# Altium schematic sheet [SH][SFW2] V1.0.SchDoc
size A4
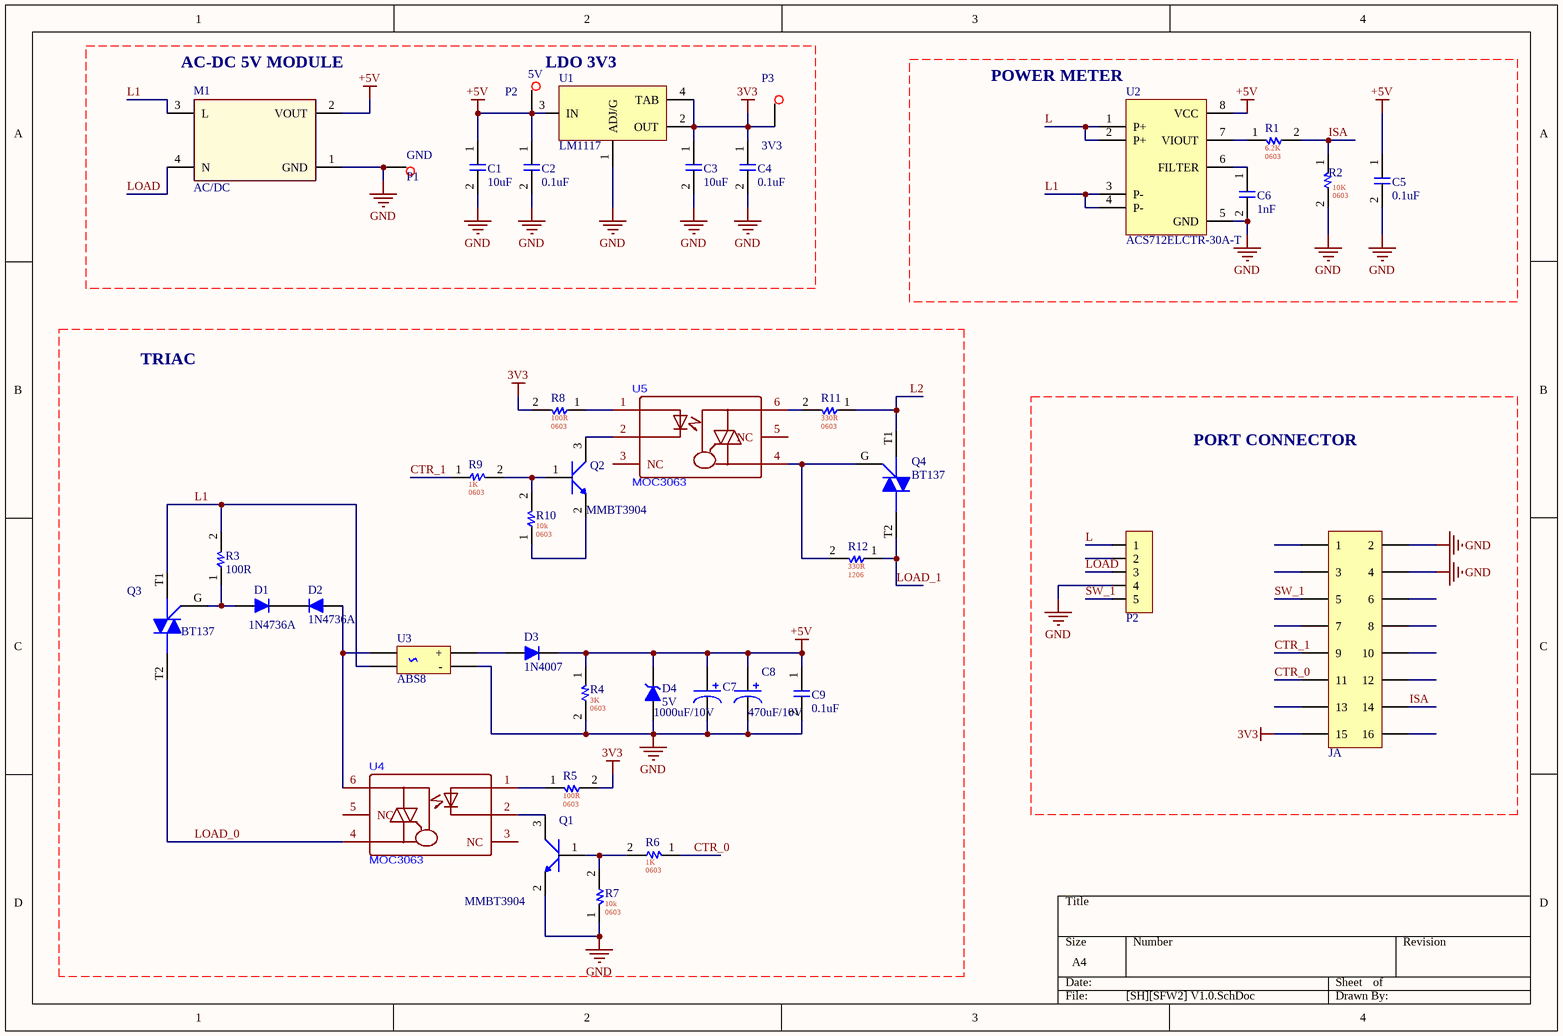
[diagram p0: [SH][SFW2] V1.0.SchDoc]

## Parts
3V3  P3  [TEXT_POINT]
5V  P2  [TEXT_POINT]
C1  10uF  [0805 C]
C2  0.1uF  [0603 C]
C3  10uF  [0805 C]
C4  0.1uF  [0603 C]
C5  0.1uF  [0603 C]
C6  1nF  [0603 C]
C7  1000uF/10V  [CAPAP 8X11.5 P3.5]
C8  470uF/10V  [CAPAE 5X9 P2 ORANGE]
C9  0.1uF  [0603 C]
D1  1N4736A  [DO214AC]
D2  1N4736A  [DO214AC]
D3  1N4007  [SOD-323]
D4  5V  [SOD-80C]
GND  P1  [TEXT_POINT]
JA  rao doi  [T]  (value not drawn)
M1  AC/DC  [AC-DC 5V K4H24]
P2  P5  [TBL004V]  (value not drawn)
Q1  MMBT3904  [SOT 23-3]
Q2  MMBT3904  [SOT 23-3]
Q3  BT137  [TO_252]
Q4  BT137  [TO_252]
R1  value 6.2K  FP: 0603  [0603 R]  (hidden comment: 3K)
R2  value 10K  FP: 0603  [0603 R]  (hidden comment: 3K)
R3  100R  [0805 R]
R4  FP: 0603  [0603 R]  (hidden comment: 3K)
R5  FP: 0603  [0603 R]  (hidden comment: 100R)
R6  FP: 0603  [0603 R]  (hidden comment: 1K)
R7  FP: 0603  [0603 R]  (hidden comment: 10k)
R8  FP: 0603  [0603 R]  (hidden comment: 100R)
R9  FP: 0603  [0603 R]  (hidden comment: 1K)
R10  FP: 0603  [0603 R]  (hidden comment: 10k)
R11  value 330R  FP: 0603  [0603 R]  (hidden comment: 100R)
R12  value 330R  FP: 1206  [0603 R]  (hidden comment: 100R)
U1  LM1117  [SOT23-4]
U2  ACS712ELCTR-30A-T  [SOIC 8]
U3  ABS8  [4PIN SOP]
U4  MOC3063  [TO252]
U5  MOC3063  [TO252]

## Nets
3V3: 3V3.1(P) C3.1 C4.1 JA.15 R5.2 R8.2 U1.2(OUT) U1.4(TAB)
+5V: 5V.1(P) C1.1 C2.1 C5.1 C7.1 C8.1 C9.1 D3.2 D4.2 M1.2(VOUT) R4.1 U1.3(IN) U2.8(VCC)
GND: C1.2 C2.2 C3.2 C4.2 C5.2 C6.2 C7.2 C8.2 C9.2 D4.1 GND.1(P) JA.2 JA.4 M1.1(GND) P2.4 Q1.2(E) R2.2 R4.2 R7.1 U1.1(ADJ/G) U2.5(GND) U3.2(-)
CTR_0: JA.11 R6.1
CTR_1: JA.9 R9.1
ISA: JA.14 R1.2 R2.1
L: P2.1 U2.1(P+) U2.2(P+)
L1: M1.3(L) Q3.T1 R3.2 U2.3(P-) U2.4(P-) U3.4
L2: Q4.T1 R11.1
LOAD: M1.4(N) P2.3
LOAD_0: Q3.T2 U4.4(MT)
LOAD_1: Q4.T2 R12.1
SW_1: JA.5 P2.5
NetC6_1: C6.1 U2.6(FILTER)
NetD1_1: D1.1 Q3.G R3.1
NetD1_2: D1.2 D2.2
NetD2_1: D2.1 U3.3 U4.6(MT)
NetD3_1: D3.1 U3.1(+)
NetQ1_1: Q1.1(B) R6.2 R7.2
NetQ1_3: Q1.3(C) U4.2(CAT)
NetQ2_1: Q2.1(B) R9.2 R10.2
NetQ2_2: Q2.2(E) R10.1
NetQ2_3: Q2.3(C) U5.2(CAT)
NetQ4_G: Q4.G R12.2 U5.4(MT)
NetR1_1: R1.1 U2.7(VIOUT)
NetR5_1: R5.1 U4.1(AN)
NetR8_1: R8.1 U5.1(AN)
NetR11_2: R11.2 U5.6(MT)

Not connected (* = marked no-connect by the designer): JA 1 3 6 7 8 10 12 13 16; P2 2; U4 3(NC) 5(NC); U5 3(NC) 5(NC)

## Notes on the sheet
- (near M1) AC-DC 5V MODULE
- LDO 3V3
- (near U2) POWER METER
- TRIAC
- PORT CONNECTOR

## Library data of the parts
3V3 5V = P1
C1 C3 = CAP NOP: 0603 10 uF 10 V ±10% Tolerance X5R Multilayer Ceramic Chip Capacitor; PN: *
C2 C4 C5 C9 = CAP NOP: Cap Ceramic 0.1uF 10V X7R 10% SMD 0603 125°C Paper T/R; PN: *
C6 = CAP NOP: CAP CER 0603 1NF 10V ULTRA STABL; PN: *
C7 = CAP POLAR: Cap Aluminum Lytic 1000uF 10V 20% (10 X 16mm) Radial 5mm 1790mA 4000h 105C Ammo
C8 = CAP POLAR: Cap Aluminum 470uF 10V 20% (8 X 11.5mm) Radial 5mm 950mA 3000h 105C Ammo Pack
D1 D2 = Diode schottky: 1N4736 Series 1 W 6.8 V 10 uA Axial Through Hole Zener Diode - DO-41; PN: *
D3 = Diode schottky: Diode Standard 1000V 1A Through Hole DO-204AL (DO-41); PN: *
D4 = Diode Zener: Diode Zener 5V 1W; Editor: MMUOP; Value: *; PN: *
JA = P2x8: Hàng Rào Cái Đôi 2.54mm 16Chân 2 Hàng SMD / Female Header 2.54mm 16 Way 2 Row SMD
M1 = AC/DC: AC-DC 5V 700mA 3.5W Power Supply Buck Converter Step Down Module 220V To 5V
Q1 Q2 = TRANS NPN: Bipolar (BJT) Transistor NPN 40 V 200 mA 300MHz 350 mW Surface Mount SOT-23-3 (TO-236)
Q3 Q4 = TRIAC: TRIAC Standard 600 V 8 A Surface Mount D2PAK
R1 = 0603 10k 1%: 6.2KΩ 1% 0603 SMD; PN: C98220; PACKAGE: SMD; DATE: 04-Mar-21; CREATOR: MMUOP; ComponentLink1Description: New link; ComponentLink1URL: *; VOLTAGE + TOLE: 1%
R2 R7 R10 = 0603 10k 1%: 10KΩ 1% 0603 SMD; PN: C98220; PACKAGE: SMD; DATE: 04-Mar-21; CREATOR: MMUOP; ComponentLink1Description: New link; ComponentLink1URL: *; VOLTAGE + TOLE: 1%
  R7 R10: VALUE: 10k
R3 = Res SMD: 100KΩ 1% 0805 SMD
R4 = 0603 10k 1%: 3KΩ 0603 SMD; PN: C98220; VOLTAGE + TOLE: 1%; PACKAGE: SMD; DATE: 04-Mar-21; CREATOR: MMUOP; ComponentLink1Description: New link; ComponentLink1URL: *; VALUE: 3K
R5 R8 R11 R12 = 0603 10k 1%: 100R 1% 0603 SMD; PN: C98220; PACKAGE: SMD; DATE: 04-Mar-21; CREATOR: MMUOP; ComponentLink1Description: New link; ComponentLink1URL: *; VOLTAGE + TOLE: 1%
  R5 R8: VALUE: 100R
R6 R9 = 0603 10k 1%: 1KΩ 1% 0603 SMD; PN: C98220; PACKAGE: SMD; DATE: 04-Mar-21; CREATOR: MMUOP; ComponentLink1Description: New link; ComponentLink1URL: *; VOLTAGE + TOLE: 1%; VALUE: 1K
U1 = LM1117: 800-mA 15-V linear voltage regulator 4-SOT-223
U2 = ACS71240: Current Sensor 30A 1 Channel Hall Effect, Open Loop Bidirectional 8-SOIC (0.154", 3.90mm Width); ComponentLink1Description: New link; ComponentLink1URL: https://banlinhkiendientu.vn/acs712t/
U3 = DIODE BRIGH: Bridge Rectifier Single Phase Standard 800V Surface Mount ABS
U4 U5 = CYMOC3063: Optoisolator Triac Output 4170Vrms 1 Channel 6-SMD; ComponentLink1Description: New link; ComponentLink1URL: https://www.thegioiic.com/products/moc3063m-optoisolator-triac-output-4170vrms-1-channel-6-dip